# Altium project AEGIS_Junction_Box_driver.PrjPcb
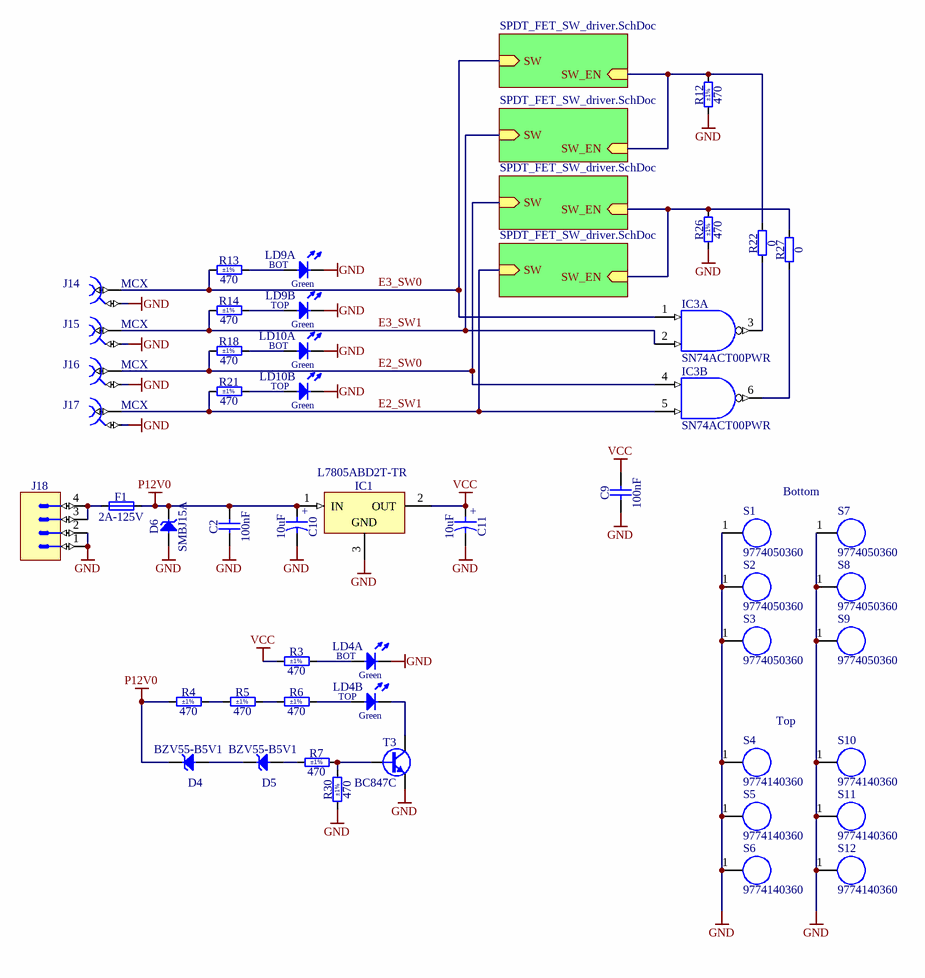
[diagram p0: AEGIS_Junction_Box_driver.SchDoc]
2 sheets, 181 parts. Net scope: hierarchical (ports join the sheet entries above them; power ports are global).
Board file: AEGIS_Junction_Box_driver.PcbDoc
Sheets:
  AEGIS_Junction_Box_driver.SchDoc
    SPDT_HV_SW0 = SPDT_FET_SW_driver.SchDoc
    SPDT_HV_SW1 = SPDT_FET_SW_driver.SchDoc
    SPDT_HV_SW2 = SPDT_FET_SW_driver.SchDoc
    SPDT_HV_SW3 = SPDT_FET_SW_driver.SchDoc

## Sheet AEGIS_Junction_Box_driver.SchDoc: AEGIS
size 420 x 297 mm; Author: G.Kasprowicz; CompanyName: WUT ISE; DrawnBy: G.Kasprowicz; Organization: WUT ISE; Address1: PW ISE; Address2: Nowowiejska 15/19 00-665 Warsaw; Address3: gkasprow@gmail.com; Revision: 2; SheetNumber: -; SheetTotal: -; ModifiedBy: -; CheckedDate: -; Title2: Junction Box Driver; DivGrp: WUT ISE; Designer: G.Kasprowicz; ModifiedDate: -; ProjectName: Sensor Box

### Parts
C2  100nF  [CAPC1005X55N]
C9  100nF  [CAPC1005X55N]
C10  10uF  [CAPMP3216X180N]
C11  10uF  [CAPMP3216X180N]
D4  BZV55-B5V1  [DIOMELF3515N]
D5  BZV55-B5V1  [DIOMELF3515N]
D6  SMBJ15A  [DIOM5336X265N]
F1  2A-125V  [FUSE_LITTELFUSE_0154]
IC1  L7805ABD2T-TR  [TO254P1542X460-3N-R790X1040]
IC3  SN74ACT00PWR  [SOP65P640X120-14N]  (parts A,B of 4)
J14  MCX  [AMPHENOL_919-383J-51A]
J15  MCX  [AMPHENOL_919-383J-51A]
J16  MCX  [AMPHENOL_919-383J-51A]
J17  MCX  [AMPHENOL_919-383J-51A]
J18  Mini-Fit Jr.™  [MOLEX_39-30-0040]  (value not drawn)
LD4  Green  [LED_DIALIGHT_553-0222-210F]  (value not drawn)  (parts A,B of 2)
LD9  Green  [LED_DIALIGHT_553-0222-210F]  (value not drawn)  (parts A,B of 2)
LD10  Green  [LED_DIALIGHT_553-0222-210F]  (value not drawn)  (parts A,B of 2)
R3  470  Tolerance: ±1%  [RESC1608X55N]
R4  470  Tolerance: ±1%  [RESC1608X55N]
R5  470  Tolerance: ±1%  [RESC1608X55N]
R6  470  Tolerance: ±1%  [RESC1608X55N]
R7  470  Tolerance: ±1%  [RESC1608X55N]
R12  470  Tolerance: ±1%  [RESC1608X55N]
R13  470  Tolerance: ±1%  [RESC1608X55N]
R14  470  Tolerance: ±1%  [RESC1608X55N]
R18  470  Tolerance: ±1%  [RESC1608X55N]
R21  470  Tolerance: ±1%  [RESC1608X55N]
R22  0  [RESC1608X55N]
R26  470  Tolerance: ±1%  [RESC1608X55N]
R27  0  [RESC1608X55N]
R30  470  Tolerance: ±1%  [RESC1608X55N]
S1  9774050360  [9774050360]
S2  9774050360  [9774050360]
S3  9774050360  [9774050360]
S4  9774140360  [9774140360]
S5  9774140360  [9774140360]
S6  9774140360  [9774140360]
S7  9774050360  [9774050360]
S8  9774050360  [9774050360]
S9  9774050360  [9774050360]
S10  9774140360  [9774140360]
S11  9774140360  [9774140360]
S12  9774140360  [9774140360]
T3  BC847C  [SOT95P240X110-3N]

### Sub-sheets
SPDT_HV_SW0 = SPDT_FET_SW_driver.SchDoc: SW (in), SW_EN (in)
SPDT_HV_SW1 = SPDT_FET_SW_driver.SchDoc: SW (in), SW_EN (in)
SPDT_HV_SW2 = SPDT_FET_SW_driver.SchDoc: SW (in), SW_EN (in)
SPDT_HV_SW3 = SPDT_FET_SW_driver.SchDoc: SW (in), SW_EN (in)

### Nets
GND: C2.1 C9.1 C10.2 C11.2 D6.2(A) IC1.3(GND) IC3.7(GND) J14.2 J15.2 J16.2 J17.2 J18.1 J18.2 LD4.2(C) LD9.2(C) LD9.4(C) LD10.2(C) LD10.4(C) R12.1 R26.1 R30.1 S1.1 S2.1 S3.1 S4.1 S5.1 S6.1 S7.1 S8.1 S9.1 S10.1 S11.1 S12.1 T3.2(E)
P12V0: C2.2 C10.1 D4.1(C) D6.1(C) F1.2 IC1.1(IN) R4.1
VCC: C9.2 C11.1 IC1.2(OUT) IC3.14(VCC) R3.1
E2_SW0: IC3.4(A) J16.1 R18.1 ; sheet SPDT_HV_SW2/SW
E2_SW1: IC3.5(B) J17.1 R21.1 ; sheet SPDT_HV_SW3/SW
E3_SW0: IC3.1(A) J14.1 R13.1 ; sheet SPDT_HV_SW0/SW
E3_SW1: IC3.2(B) J15.1 R14.1 ; sheet SPDT_HV_SW1/SW
NetD4_2: D4.2(A) D5.1(C)
NetD5_2: D5.2(A) R7.1
NetF1_1: F1.1 J18.3 J18.4
NetIC2A_1: R12.2 R22.2 ; sheet SPDT_HV_SW0/SW_EN, sheet SPDT_HV_SW1/SW_EN
NetIC2C_1: R26.2 R27.2 ; sheet SPDT_HV_SW2/SW_EN, sheet SPDT_HV_SW3/SW_EN
NetIC3_3: IC3.3(~{O}) R22.1
NetIC3_6: IC3.6(~{O}) R27.1
NetLD4_1: LD4.1(A) R3.2
NetLD4_3: LD4.3(A) R6.2
NetLD4_4: LD4.4(C) T3.3(C)
NetLD9_1: LD9.1(A) R13.2
NetLD9_3: LD9.3(A) R14.2
NetLD10_1: LD10.1(A) R18.2
NetLD10_3: LD10.3(A) R21.2
NetR4_2: R4.2 R5.1
NetR5_2: R5.2 R6.1
NetR7_2: R7.2 R30.2 T3.1(B)

### Notes on the sheet
- Bottom
- Top
- Project/Equipment
- Document
- Designer
- Drawn by
- Check.by
- Copyright WUT ISE 2020.
  This documentation describes Open Hardware and is licensed under the CERN OHL v.1.2. You may redistribute and modify this documentation under the terms of the CERN OHL v.1.2. (http://ohwr.org/CERNOHL). This documentation is distributed WITHOUT ANY EXPRESS OR IMPLIED WARRANTY, INCLUDING OF MERCHANTABILITY, SATISFACTORY QUALITY AND FITNESS FOR A PARTICULAR PURPOSE. Please see the CERN OHL v.1.2 for applicable conditions.
- Contact
- File
- Last Mod.
- Print Date
- Sheet
- Size
- A3
- of
- Rev
- (in symbol CTE3216-18_10UF_16V_20%_AVX_TCJ) +
- (in symbol LED_DIALIGHT_553-0222-210F, part A) BOT
- (in symbol LED_DIALIGHT_553-0222-210F, part B) TOP

### Library data of the parts
C2 C9 = CC0402_100NF_16V_10%_X7R: Non-polarised capacitor; Part Description: SMD Multilayer Chip Ceramic Capacitor; Manufacturer: GENERIC; Manufacturer1 Part Number: GRM155R71C104KA88D; Voltage: 16V; TC: X7R; Tolerance: ±10%; Part Number: CC0402_100NF_16V_10%_X7R; Component Kind: Standard; Component Type: Standard; Pin Count: 2; Value: 100nF; Status: Not Recommended; Manufacturer Part Number: CC0402_100NF_16V_10%_X7R; Case: 0402; Mounted: Yes; Socket: No; SMD: Yes; Sense: No; Manufacturer1 Example: MURATA; Manufacturer1 ComponentHeight: 0.55mm; HelpURL: \\cern.ch\dfs\Applications\Altium\Datasheets\CC0402_X7R_MURATA_GRM.pdf; Author: CERN DEM JLC; CreateDate: 05.12.2013; LatestRevisionDate: 03.12.2007
C10 C11 = CTE3216-18_10UF_16V_20%_AVX_TCJ: Polarised capacitor; Part Description: ESR 0R200 Tantalum Solid Electrolytic Chip Capacitor with Conductive Polymer Electrode; Manufacturer: AVX; Manufacturer Part Number: TCJA106M016R0200; Voltage: 16V; Tolerance: ±20%; Part Number: CTE3216-18_10UF_16V_20%_AVX_TCJ; Component Kind: Standard; Component Type: Standard; Pin Count: 2; Value: 10uF; Status: Preferred; Case: A; Mounted: Yes; Socket: No; SMD: Yes; Sense: No; ComponentHeight: 1.8mm; HelpURL: \\cern.ch\dfs\Applications\Altium\Datasheets\CTE_AVX_TCJ.pdf; Author: CERN DEM JLC; CreateDate: 29.03.2012; LatestRevisionDate: 29.03.2012
D4 D5 = BZV55-B5V1: Zener Diode; Part Description: Voltage Regulator Diode; Manufacturer: NEXPERIA; Voltage: 5V1; Power: 500mW; PressFit: No; Bonding: No; Part Number: BZV55-B5V1; Component Kind: Standard; Component Type: Standard; Device: BZV55-B5V1; PackageDescription: SOD80C, MELF Diode, 2-Leads, Body 3.5x1.5mm, IPC Medium Density; Manufacturer Part Number: BZV55-B5V1; Pin Count: 2; Case: SOD-80C; Mounted: Yes; Socket: No; SMD: Yes; Sense: No; ComponentHeight: 1.6mm; HelpURL: \\cern.ch\dfs\Applications\Altium\Datasheets\BZV55.pdf; Author: CERN DEM JLC; CreateDate: 06.05.2008; LatestRevisionDate: 22.01.2018
D6 = SMBJ15A: Zener Diode; Part Description: Uni-Directional Transient Voltage Suppressor Diode; Manufacturer: FAIRCHILD SEMICONDUCTOR; Voltage: 15V; Power: 600W; PressFit: No; Bonding: No; Part Number: SMBJ15A; Component Kind: Standard; Component Type: Standard; Device: SMBJ15A; PackageDescription: DO-214-AA/SMB Diode, Molded Body; 5.34mm L X 3.625mm W X 2.65mm H, IPC Medium Density; Manufacturer Part Number: SMBJ15A; Pin Count: 2; Case: DO-214AA; Mounted: Yes; Socket: No; SMD: Yes; Sense: No; ComponentHeight: 2.65mm; HelpURL: \\cern.ch\dfs\Applications\Altium\Datasheets\SMBJ.pdf; Author: CERN DEM JLC; CreateDate: 08.12.2008; LatestRevisionDate: 19.12.2011
F1 = FUSE_LITTELFUSE_0154002.DRT: Fuse; Part Description: SMF OMNI-BLOK® Fuse With Time Lag (Slo-Blo®) and Holder; PressFit: No; Part Number: FUSE_LITTELFUSE_0154002.DRT; Component Kind: Standard; Component Type: Standard; Pin Count: 2; PackageDescription: SMF Fuse and Holder, 2-Leads, Body 9.73x5.03mm; Family: Fuse & Holder; Mounted: Yes; Socket: No; SMD: Yes; Sense: No; Value: 2A-125V; Manufacturer: LITTELFUSE; Manufacturer Part Number: 0154002.DRT; ComponentHeight: 3.81mm; HelpURL: \\cern.ch\dfs\Applications\Altium\Datasheets\FUSE_LITTELFUSE_0154.pdf; Author: CERN DEM JLC; CreateDate: 06.08.2009; LatestRevisionDate: 06.08.2009
IC1 = L7805ABD2T-TR: 3-Terminal Regulator 1=IN 2=OUT 3=GND; Part Description: 5V 1.5A Positive Voltage Regulator; Manufacturer: ST MICROELECTRONICS; PressFit: No; Bonding: No; Part Number: L7805ABD2T-TR; Component Kind: Standard; Component Type: Standard; Device: L7805ABD2T-TR; PackageDescription: D2PAK TO-263, TO, 2.54mm Pitch; 2 Pin, 15.425mm L X 9.15mm W X 4.60mm H body, IPC Medium Density; Manufacturer Part Number: L7805ABD2T-TR; Pin Count: 3; Case: TO-263-2; Mounted: Yes; Socket: No; SMD: Yes; Sense: No; ComponentHeight: 4.6mm; HelpURL: \\cern.ch\dfs\Applications\Altium\Datasheets\L7805ABD2T-TR.pdf; Author: CERN DEM JLC; CreateDate: 13.12.2011; LatestRevisionDate: 13.12.2011
IC3 = SN74ACT00PWR: Quad 2-Input NAND Gate; Part Description: Quadruple 2-Input Positive-NAND Gate; Manufacturer: TEXAS INSTRUMENTS; PressFit: No; Bonding: No; Part Number: SN74ACT00PWR; Component Kind: Standard; Component Type: Standard; Device: SN74ACT00PWR; PackageDescription: SOP, 0.65mm Pitch; 14 Pin, 4.40mm W X 5.00mm L X 1.20mm H body, IPC Medium Density; Manufacturer Part Number: SN74ACT00PWR; Pin Count: 14; Case: TSSOP14; Mounted: Yes; Socket: No; SMD: Yes; Sense: No; ComponentHeight: 1.2mm; Author: CERN DEM JLC; HelpURL: \\cern.ch\dfs\Applications\Altium\Datasheets\SN74ACT00PWR.pdf; CreateDate: 17.03.2014; LatestRevisionDate: 17.03.2014
J14-J17 = AMPHENOL_919-383J-51A: Part Description: 50 Ohm, RF Connector, MCX Right Angle PCB Receptacle Jack; PressFit: No; Part Number: AMPHENOL_919-383J-51A; Component Kind: Standard; Component Type: Standard; Pin Count: 5; Family: MCX; Mounted: Yes; Socket: No; SMD: No; Sense: No; Status: None; Manufacturer: AMPHENOL; Manufacturer Part Number: 919-383J-51A; ComponentHeight: 6mm; HelpURL: \\cern.ch\dfs\Applications\Altium\Datasheets\AMPHENOL_919-383J-51A.pdf; Author: CERN DEM BC; CreateDate: 31.01.2019; LatestRevisionDate: 31.01.2019
J18 = MOLEX_39-30-0040: Connector 4 Male; Part Description: 4.20mm (.165") Pitch Mini-Fit Jr. Header, Dual Row, Right Angle with Snap-in Plastic Peg PCB Lock, 4 Circuits; Manufacturer: MOLEX; PressFit: No; Part Number: MOLEX_39-30-0040; Component Kind: Standard; Component Type: Standard; Pin Count: 4; Family: Mini-Fit Jr.™; Mounted: Yes; Socket: No; SMD: No; Sense: No; Status: None; Manufacturer Part Number: 39-30-0040; ComponentHeight: 11.4mm; HelpURL: \\cern.ch\dfs\Applications\Altium\Datasheets\MOLEX_39-30-0040.pdf; Author: CERN DEM JLC; CreateDate: 2018-10-02; LatestRevisionDate: 2018-10-02
LD4 LD9 LD10 = LED_DIALIGHT_553-0222-210F: LED x2 Green 1A2C-BOT_3A4C-TOP; Part Description: Dual 3mm Green LED CBI® Circuit Board Indicator, Low Current, Reverse Cathode Right; PressFit: No; Bonding: No; Part Number: LED_DIALIGHT_553-0222-210F; Component Kind: Standard; Component Type: Standard; Color: Green; PackageDescription: Dual 3mm Green LED, Body 10.55x4.32mm, Pin spacing 2.54mm, Reverse Cathode Right; Manufacturer: DIALIGHT; Manufacturer Part Number: 553-0222-210F; Pin Count: 4; Mounted: Yes; Socket: No; SMD: No; Sense: No; ComponentHeight: 9.65mm; HelpURL: \\cern.ch\dfs\Applications\Altium\Datasheets\LED_DIALIGHT_553-0222-210F.pdf; Author: CERN DEM BC; CreateDate: 18.08.2016; LatestRevisionDate: 18.08.2016
R3-R7 R12-R14 R18 R21 R26 R30 = R0603_470R_1%_0.1W_100PPM: Resistor - 1%; Part Description: General Purpose Thick Film Chip Resistor; Manufacturer: GENERIC; Manufacturer1 Part Number: NRC06F4700TRF; Power: 0.1W; TC: ±100ppm/°C; PressFit: No; Part Number: R0603_470R_1%_0.1W_100PPM; Component Kind: Standard; Component Type: Standard; Pin Count: 2; Value: 470; Status: Preferred; Manufacturer Part Number: R0603_470R_1%_0.1W_100PPM; Case: 0603; Mounted: Yes; Sense: No; Socket: No; SMD: Yes; Manufacturer1 Example: NIC COMPONENT; Manufacturer1 ComponentHeight: 0.55mm; HelpURL: \\cern.ch\dfs\Applications\Altium\Datasheets\R0603_NIC_NRC.pdf; Author: CERN DEM JLC; CreateDate: 03.12.2007; LatestRevisionDate: 13.03.2008
R22 R27 = R0603_0R_JUMPER: Resistor; Part Description: 1A (0.05R Max DC Resistance) Zero Ohm Jumper; Manufacturer: GENERIC; Manufacturer1 Part Number: NRC06Z0; PressFit: No; Part Number: R0603_0R_JUMPER; Component Kind: Standard; Component Type: Standard; Pin Count: 2; Value: 0; Status: Preferred; Manufacturer Part Number: R0603_0R_JUMPER; Case: 0603; Mounted: Yes; Sense: No; Socket: No; SMD: Yes; Manufacturer1 Example: NIC COMPONENT; Manufacturer1 ComponentHeight: 0.55mm; HelpURL: \\cern.ch\dfs\Applications\Altium\Datasheets\R0603_NIC_NRC.pdf; Author: CERN DEM JLC; CreateDate: 03.12.2007; LatestRevisionDate: 13.03.2008
S1-S3 S7-S9 = WA-SMSI,  9774050360: WA-SMSI SMD Steel Spacer with internal Thread; Manufacturer: Wurth Elektronik; partNo: 9774050360; ComponentLink1Description: Manufacturer; ComponentLink1URL: http://www.we-online.de; Created by: Baojun Chen; Created Date: 20.Oct.2015; ComponentLink2Description: Datasheet; ComponentLink2URL: http://katalog.we-online.de/em/datasheet/9774050360.pdf
S4-S6 S10-S12 = WA-SMSI,  9774140360: WA-SMSI SMD Steel Spacer with internal Thread; Manufacturer: Wurth Elektronik; partNo: 9774140360; ComponentLink1Description: Manufacturer; ComponentLink1URL: http://www.we-online.de; Created by: Baojun Chen; Created Date: 20.Oct.2015; ComponentLink2Description: Datasheet; ComponentLink2URL: http://katalog.we-online.de/em/datasheet/9774140360.pdf
T3 = BC847C: NPN Transistor; Part Description: 45V 100mA NPN Silicon AF Transistor; Manufacturer: INFINEON; PressFit: No; Bonding: No; Part Number: BC847C; Component Kind: Standard; Component Type: Standard; Device: BC847C; PackageDescription: SOT23, 0.95mm Pitch; 3 Pin, 1.40mm W X 3.00mm L X 1.10mm H body, IPC Medium Density; Manufacturer Part Number: BC847C; Pin Count: 3; Case: SOT23-3; Mounted: Yes; Socket: No; SMD: Yes; Sense: No; ComponentHeight: 1.1mm; HelpURL: \\cern.ch\dfs\Applications\Altium\Datasheets\BC847C.pdf; Author: CERN DEM JLC; CreateDate: 23.09.2014; LatestRevisionDate: 23.09.2014

## Sheet SPDT_FET_SW_driver.SchDoc: AEGIS
size 420 x 297 mm; Author: G.Kasprowicz; CompanyName: WUT ISE; DrawnBy: G.Kasprowicz; Organization: WUT ISE; Address1: PW ISE; Address2: Nowowiejska 15/19 00-665 Warsaw; Address3: gkasprow@gmail.com; Revision: 2; SheetNumber: -; SheetTotal: -; ModifiedBy: -; CheckedDate: -; Title2: Switch driver; DivGrp: WUT ISE; Designer: G.Kasprowicz; ModifiedDate: -; ProjectName: Sensor Box
Used 4 times, as channels SPDT_HV_SW0, SPDT_HV_SW1, SPDT_HV_SW2, SPDT_HV_SW3. Parts and nets are listed once, with the designators drawn on the sheet.
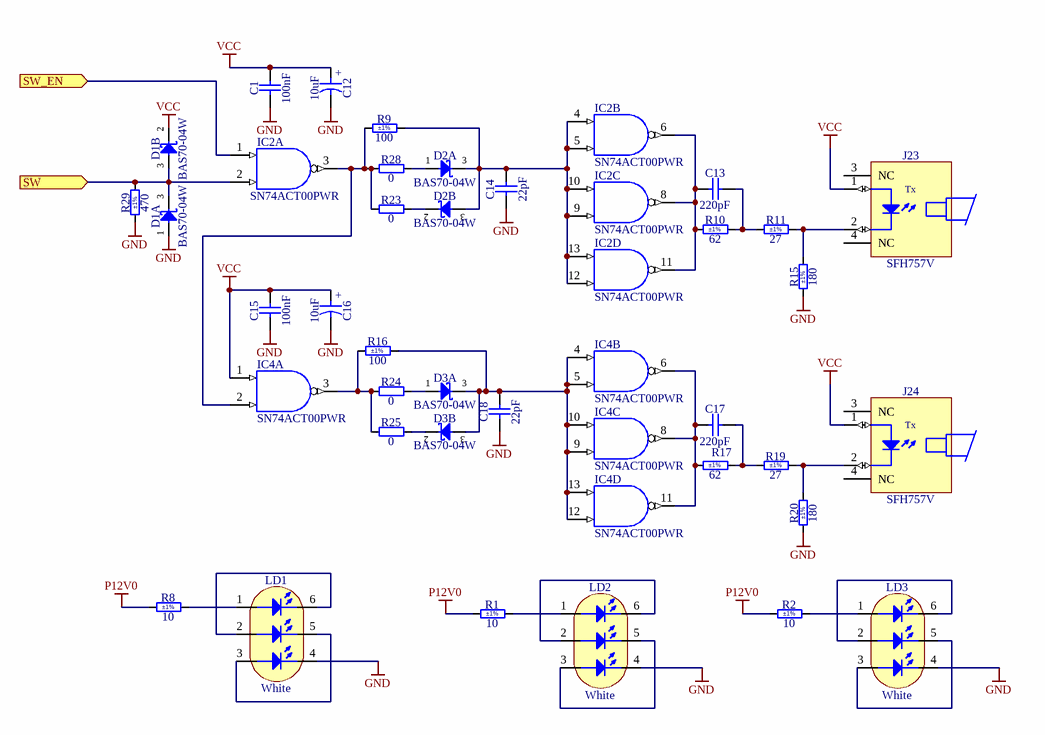
[diagram p1: SPDT_FET_SW_driver.SchDoc]

### Parts
C1  100nF  [CAPC1005X55N]
C12  10uF  [CAPMP3216X180N]
C13  220pF  [CAPC1608X87N]
C14  22pF  [CAPC1608X87N]
C15  100nF  [CAPC1005X55N]
C16  10uF  [CAPMP3216X180N]
C17  220pF  [CAPC1608X87N]
C18  22pF  [CAPC1608X87N]
D1  BAS70-04W  [SOT65P210X110-3N]  (parts A,B of 2)
D2  BAS70-04W  [SOT65P210X110-3N]  (parts A,B of 2)
D3  BAS70-04W  [SOT65P210X110-3N]  (parts A,B of 2)
IC2  SN74ACT00PWR  [SOP65P640X120-14N]  (parts A,B,C,D of 4)
IC4  SN74ACT00PWR  [SOP65P640X120-14N]  (parts A,B,C,D of 4)
J23  SFH757V  [SFH756V]
J24  SFH757V  [SFH756V]
LD1  White  [LED_CREE_CLP6B-WKW]
LD2  White  [LED_CREE_CLP6B-WKW]
LD3  White  [LED_CREE_CLP6B-WKW]
R1  10  Tolerance: ±1%  [RESC3216X65N]
R2  10  Tolerance: ±1%  [RESC3216X65N]
R8  10  Tolerance: ±1%  [RESC3216X65N]
R9  100  Tolerance: ±1%  [RESC1608X55N]
R10  62  Tolerance: ±1%  [RESC2012X60N]
R11  27  Tolerance: ±1%  [RESC2012X60N]
R15  180  Tolerance: ±1%  [RESC3216X65N]
R16  100  Tolerance: ±1%  [RESC1608X55N]
R17  62  Tolerance: ±1%  [RESC2012X60N]
R19  27  Tolerance: ±1%  [RESC2012X60N]
R20  180  Tolerance: ±1%  [RESC3216X65N]
R23  0  [RESC1608X55N]
R24  0  [RESC1608X55N]
R25  0  [RESC1608X55N]
R28  0  [RESC1608X55N]
R29  470  Tolerance: ±1%  [RESC1608X55N]

### Ports
SW (in), SW_EN (in)

### Nets
GND: C1.1 C12.2 C14.1 C15.1 C16.2 C18.1 D1.1(A) IC2.7(GND) IC4.7(GND) LD1.4(C3) LD2.4(C3) LD3.4(C3) R15.1 R20.1 R29.1
P12V0: R1.1 R2.1 R8.1
VCC: C1.2 C12.1 C15.2 C16.1 D1.2(C) IC2.14(VCC) IC4.1(A) IC4.14(VCC) J23.1(A) J24.1(A)
SW: D1.3(COMAC) IC2.2(B) R29.2 ; port SW
SW_EN: IC2.1(A) ; port SW_EN
NetC13_1: C13.1 IC2.6(~{O}) IC2.8(~{O}) IC2.11(~{O}) R10.1
NetC13_2: C13.2 R10.2 R11.1
NetC14_2: C14.2 D2.3(COMAC) IC2.4(A) IC2.5(B) IC2.9(B) IC2.10(A) IC2.12(B) IC2.13(A) R9.2
NetC17_1: C17.1 IC4.6(~{O}) IC4.8(~{O}) IC4.11(~{O}) R17.1
NetC17_2: C17.2 R17.2 R19.1
NetC18_2: C18.2 D3.3(COMAC) IC4.4(A) IC4.5(B) IC4.9(B) IC4.10(A) IC4.12(B) IC4.13(A) R16.2
NetD2_1: D2.1(A) R28.2
NetD2_2: D2.2(C) R23.2
NetD3_1: D3.1(A) R24.2
NetD3_2: D3.2(C) R25.2
NetIC2_3: IC2.3(~{O}) IC4.2(B) R9.1 R23.1 R28.1
NetIC4_3: IC4.3(~{O}) R16.1 R24.1 R25.1
NetJ23_2: J23.2(C) R11.2 R15.2
NetJ24_2: J24.2(C) R19.2 R20.2
NetLD1_1: LD1.1(A1) R8.2
NetLD1_2: LD1.2(A2) LD1.6(C1)
NetLD1_3: LD1.3(A3) LD1.5(C2)
NetLD2_1: LD2.1(A1) R1.2
NetLD2_2: LD2.2(A2) LD2.6(C1)
NetLD2_3: LD2.3(A3) LD2.5(C2)
NetLD3_1: LD3.1(A1) R2.2
NetLD3_2: LD3.2(A2) LD3.6(C1)
NetLD3_3: LD3.3(A3) LD3.5(C2)

Not connected (* = marked no-connect by the designer): J23 3(NC) 4(NC); J24 3(NC) 4(NC)

### Channels
SPDT_HV_SW0: designators end in A; ports SW=E3_SW0 SW_EN=NetIC2A_1
SPDT_HV_SW1: designators end in B; ports SW=E3_SW1 SW_EN=NetIC2A_1
SPDT_HV_SW2: designators end in C; ports SW=E2_SW0 SW_EN=NetIC2C_1
SPDT_HV_SW3: designators end in D; ports SW=E2_SW1 SW_EN=NetIC2C_1

### Notes on the sheet
- Project/Equipment
- Document
- Designer
- Drawn by
- Check.by
- Copyright WUT ISE 2020.
  This documentation describes Open Hardware and is licensed under the CERN OHL v.1.2. You may redistribute and modify this documentation under the terms of the CERN OHL v.1.2. (http://ohwr.org/CERNOHL). This documentation is distributed WITHOUT ANY EXPRESS OR IMPLIED WARRANTY, INCLUDING OF MERCHANTABILITY, SATISFACTORY QUALITY AND FITNESS FOR A PARTICULAR PURPOSE. Please see the CERN OHL v.1.2 for applicable conditions.
- Contact
- File
- Last Mod.
- Print Date
- Sheet
- Size
- A3
- of
- Rev
- (in symbol CTE3216-18_10UF_16V_20%_AVX_TCJ) +
- (in symbol SFH756V) Tx

### Library data of the parts
C1 C15 = CC0402_100NF_16V_10%_X7R: as C2 on sheet AEGIS_Junction_Box_driver; Part Number: CC0402_100NF_16V_10%_X7R; Component Kind: Standard; Component Type: Standard; Pin Count: 2; Value: 100nF; Status: Not Recommended; Manufacturer Part Number: CC0402_100NF_16V_10%_X7R; Case: 0402; Mounted: Yes; Socket: No; SMD: Yes; Sense: No; Manufacturer1 Example: MURATA; Manufacturer1 ComponentHeight: 0.55mm; HelpURL: \\cern.ch\dfs\Applications\Altium\Datasheets\CC0402_X7R_MURATA_GRM.pdf; Author: CERN DEM JLC; CreateDate: 05.12.2013; LatestRevisionDate: 03.12.2007
C12 C16 = CTE3216-18_10UF_16V_20%_AVX_TCJ: as C10 on sheet AEGIS_Junction_Box_driver; Part Number: CTE3216-18_10UF_16V_20%_AVX_TCJ; Component Kind: Standard; Component Type: Standard; Pin Count: 2; Value: 10uF; Status: Preferred; Case: A; Mounted: Yes; Socket: No; SMD: Yes; Sense: No; ComponentHeight: 1.8mm; HelpURL: \\cern.ch\dfs\Applications\Altium\Datasheets\CTE_AVX_TCJ.pdf; Author: CERN DEM JLC; CreateDate: 29.03.2012; LatestRevisionDate: 29.03.2012
C13 C17 = CC0603_220PF_50V_5%_NP0: Non-polarised capacitor; Part Description: SMD Multilayer Chip Ceramic Capacitor; Manufacturer: GENERIC; Manufacturer1 Part Number: 223886715221; Voltage: 50V; TC: C0G/NP0; Tolerance: ±5%; Part Number: CC0603_220PF_50V_5%_NP0; Component Kind: Standard; Component Type: Standard; Pin Count: 2; Value: 220pF; Status: Preferred; Manufacturer Part Number: CC0603_220PF_50V_5%_NP0; Case: 0603; Mounted: Yes; Socket: No; SMD: Yes; Sense: No; Manufacturer1 Example: PHYCOMP; Manufacturer1 ComponentHeight: 0.87mm; HelpURL: \\cern.ch\dfs\Applications\Altium\Datasheets\CC0603_NP0_PHYCOMP.pdf; Author: CERN DEM JLC; CreateDate: 03.12.2007; LatestRevisionDate: 03.12.2007
C14 C18 = CC0603_22PF_50V_5%_NP0: Non-polarised capacitor; Part Description: SMD Multilayer Chip Ceramic Capacitor; Manufacturer: GENERIC; Manufacturer1 Part Number: 223886715229; Voltage: 50V; TC: C0G/NP0; Tolerance: ±5%; Part Number: CC0603_22PF_50V_5%_NP0; Component Kind: Standard; Component Type: Standard; Pin Count: 2; Value: 22pF; Status: Preferred; Manufacturer Part Number: CC0603_22PF_50V_5%_NP0; Case: 0603; Mounted: Yes; Socket: No; SMD: Yes; Sense: No; Manufacturer1 Example: PHYCOMP; Manufacturer1 ComponentHeight: 0.87mm; HelpURL: \\cern.ch\dfs\Applications\Altium\Datasheets\CC0603_NP0_PHYCOMP.pdf; Author: CERN DEM JLC; CreateDate: 03.12.2007; LatestRevisionDate: 03.12.2007
D1-D3 = BAS70-04W: Serial Schottky Diode; Part Description: Dual Series General-Purpose Schottky Diodes; Manufacturer: NXP SEMICONDUCTORS; Voltage: 70V; Power: 70mA; PressFit: No; Bonding: No; Part Number: BAS70-04W; Component Kind: Standard; Component Type: Standard; Device: BAS70-04W; PackageDescription: SOT323, 0.65mm Pitch; 3 Pin, 1.25mm W X 2.00mm L X 1.10mm H body, IPC Medium Density; Manufacturer Part Number: BAS70-04W; Pin Count: 3; Case: SOT323; Mounted: Yes; Socket: No; SMD: Yes; Sense: No; ComponentHeight: 1.10mm; HelpURL: \\cern.ch\dfs\Applications\Altium\Datasheets\BAS70-04W.pdf; Author: CERN DEM JLC; CreateDate: 05.12.2013; LatestRevisionDate: 05.12.2013
IC2 IC4 = SN74ACT00PWR: as IC3 on sheet AEGIS_Junction_Box_driver; Part Number: SN74ACT00PWR; Component Kind: Standard; Component Type: Standard; Device: SN74ACT00PWR; PackageDescription: SOP, 0.65mm Pitch; 14 Pin, 4.40mm W X 5.00mm L X 1.20mm H body, IPC Medium Density; Manufacturer Part Number: SN74ACT00PWR; Pin Count: 14; Case: TSSOP14; Mounted: Yes; Socket: No; SMD: Yes; Sense: No; ComponentHeight: 1.2mm; Author: CERN DEM JLC; HelpURL: \\cern.ch\dfs\Applications\Altium\Datasheets\SN74ACT00PWR.pdf; CreateDate: 17.03.2014; LatestRevisionDate: 17.03.2014
J23 J24 = SFH756V: Plastic Connector Housing For Plastic Fiber Optic Photodiode Detector; Part Description: 100MBd Transmitter with Direct Fiber Connector; Manufacturer: AVAGO TECHNOLOGIES; Manufacturer Part Number: SFH756V or SP000063814; PressFit: No; Part Number: SFH757V; Component Kind: Standard; Component Type: Standard; Device: SFH757V; Footprint: SFH757V; Pin Count: 4; Family: SFH757V; Mounted: Yes; Socket: No; SMD: No; Sense: No; Status: None; ComponentHeight: 9mm; HelpURL: \\cern.ch\dfs\Applications\Altium\Datasheets\SFH756V.pdf; Author: CERN DEM JLC; CreateDate: 11.11.2009; LatestRevisionDate: 21.08.2014
LD1-LD3 = LED_CREE_CLP6B-WKW-CD0E0233: PLCC6 3 in 1 Surface Mount, Cool White LED; Manufacturer: CREE; PressFit: No; Bonding: No; Part Number: LED_CREE_CLP6B-WKW-CD0E0233; Component Kind: Standard; Component Type: Standard; Color: White; PackageDescription: PLCC6 3 in 1 Surface Mount White LED, Body 6.0mm X 5.0mm; Part Description: PLCC6 3 in 1 Surface Mount, Cool White LED; Manufacturer Part Number: CLP6B-WKW-CD0E0233; Pin Count: 6; Mounted: Yes; Socket: No; SMD: Yes; Sense: No; ComponentHeight: 2.6mm; HelpURL: \\cern.ch\dfs\Applications\Altium\Datasheets\LED_CREE_CLP6B-WKW-CD0E0233.pdf; Author: CERN DEM JMW; CreateDate: 04.02.2020; LatestRevisionDate: 04.02.2020
R1 R2 R8 = R1206_10R_1%_0.25W_100PPM: Resistor - 1%; Part Description: General Purpose Thick Film Chip Resistor; Manufacturer: GENERIC; Manufacturer1 Part Number: NRC12F10R0TRF; Power: 0.25W; TC: ±100ppm/°C; PressFit: No; Part Number: R1206_10R_1%_0.25W_100PPM; Component Kind: Standard; Component Type: Standard; Pin Count: 2; Value: 10; Status: Preferred; Manufacturer Part Number: R1206_10R_1%_0.25W_100PPM; Case: 1206; Mounted: Yes; Sense: No; Socket: No; SMD: Yes; Manufacturer1 Example: NIC COMPONENT; Manufacturer1 ComponentHeight: 0.65mm; HelpURL: \\cern.ch\dfs\Applications\Altium\Datasheets\R1206_NIC_NRC.pdf; Author: CERN DEM BC; CreateDate: 14.12.2020; LatestRevisionDate: 14.12.2020
R9 R16 = R0603_100R_1%_0.1W_100PPM: Resistor - 1%; Part Description: General Purpose Thick Film Chip Resistor; Manufacturer: GENERIC; Manufacturer1 Part Number: NRC06F4700TRF; Power: 0.1W; TC: ±100ppm/°C; PressFit: No; Part Number: R0603_100R_1%_0.1W_100PPM; Component Kind: Standard; Component Type: Standard; Pin Count: 2; Value: 100; Status: Preferred; Manufacturer Part Number: R0603_100R_1%_0.1W_100PPM; Case: 0603; Mounted: Yes; Sense: No; Socket: No; SMD: Yes; Manufacturer1 Example: NIC COMPONENT; Manufacturer1 ComponentHeight: 0.55mm; HelpURL: \\cern.ch\dfs\Applications\Altium\Datasheets\R0603_NIC_NRC.pdf; Author: CERN DEM JLC; CreateDate: 03.12.2007; LatestRevisionDate: 13.03.2008
R10 R17 = R0805_62R_1%_0.125W_100PPM: Resistor - 1%; Part Description: General Purpose Thick Film Chip Resistor; Manufacturer: GENERIC; Manufacturer1 Part Number: NRC10F62R0TRF; Power: 0.125W; TC: ±100ppm/°C; PressFit: No; Part Number: R0805_62R_1%_0.125W_100PPM; Component Kind: Standard; Component Type: Standard; Pin Count: 2; Value: 62; Status: Preferred; Manufacturer Part Number: R0805_62R_1%_0.125W_100PPM; Case: 0805; Mounted: Yes; Sense: No; Socket: No; SMD: Yes; Manufacturer1 Example: NIC COMPONENT; Manufacturer1 ComponentHeight: 0.6mm; HelpURL: \\cern.ch\dfs\Applications\Altium\Datasheets\R0805_NIC_NRC.pdf; Author: CERN DEM JLC; CreateDate: 03.12.2007; LatestRevisionDate: 13.03.2008
R11 R19 = R0805_27R_1%_0.125W_100PPM: Resistor - 1%; Part Description: General Purpose Thick Film Chip Resistor; Manufacturer: GENERIC; Manufacturer1 Part Number: NRC10F27R0TRF; Power: 0.125W; TC: ±100ppm/°C; PressFit: No; Part Number: R0805_27R_1%_0.125W_100PPM; Component Kind: Standard; Component Type: Standard; Pin Count: 2; Value: 27; Status: Preferred; Manufacturer Part Number: R0805_27R_1%_0.125W_100PPM; Case: 0805; Mounted: Yes; Sense: No; Socket: No; SMD: Yes; Manufacturer1 Example: NIC COMPONENT; Manufacturer1 ComponentHeight: 0.6mm; HelpURL: \\cern.ch\dfs\Applications\Altium\Datasheets\R0805_NIC_NRC.pdf; Author: CERN DEM JLC; CreateDate: 03.12.2007; LatestRevisionDate: 13.03.2008
R15 R20 = R1206_180R_1%_0.25W_100PPM: Resistor - 1%; Part Description: General Purpose Thick Film Chip Resistor; Manufacturer: GENERIC; Manufacturer1 Part Number: NRC12F1800TRF; Power: 0.25W; TC: ±100ppm/°C; PressFit: No; Part Number: R1206_180R_1%_0.25W_100PPM; Component Kind: Standard; Component Type: Standard; Pin Count: 2; Value: 180; Status: Preferred; Manufacturer Part Number: R1206_180R_1%_0.25W_100PPM; Case: 1206; Mounted: Yes; Sense: No; Socket: No; SMD: Yes; Manufacturer1 Example: NIC COMPONENT; Manufacturer1 ComponentHeight: 0.65mm; HelpURL: \\cern.ch\dfs\Applications\Altium\Datasheets\R1206_NIC_NRC.pdf; Author: CERN DEM JLC; CreateDate: 03.12.2007; LatestRevisionDate: 13.03.2008
R23-R25 R28 = R0603_0R_JUMPER: as R22 on sheet AEGIS_Junction_Box_driver; Part Number: R0603_0R_JUMPER; Component Kind: Standard; Component Type: Standard; Pin Count: 2; Value: 0; Status: Preferred; Manufacturer Part Number: R0603_0R_JUMPER; Case: 0603; Mounted: Yes; Sense: No; Socket: No; SMD: Yes; Manufacturer1 Example: NIC COMPONENT; Manufacturer1 ComponentHeight: 0.55mm; HelpURL: \\cern.ch\dfs\Applications\Altium\Datasheets\R0603_NIC_NRC.pdf; Author: CERN DEM JLC; CreateDate: 03.12.2007; LatestRevisionDate: 13.03.2008
R29 = R0603_470R_1%_0.1W_100PPM: as R3 on sheet AEGIS_Junction_Box_driver; Part Number: R0603_470R_1%_0.1W_100PPM; Component Kind: Standard; Component Type: Standard; Pin Count: 2; Value: 470; Status: Preferred; Manufacturer Part Number: R0603_470R_1%_0.1W_100PPM; Case: 0603; Mounted: Yes; Sense: No; Socket: No; SMD: Yes; Manufacturer1 Example: NIC COMPONENT; Manufacturer1 ComponentHeight: 0.55mm; HelpURL: \\cern.ch\dfs\Applications\Altium\Datasheets\R0603_NIC_NRC.pdf; Author: CERN DEM JLC; CreateDate: 03.12.2007; LatestRevisionDate: 13.03.2008

## Nets that join several sheets
GND: AEGIS_Junction_Box_driver (34 pins), SPDT_HV_SW0 (15 pins), SPDT_HV_SW1 (15 pins), SPDT_HV_SW2 (15 pins), SPDT_HV_SW3 (15 pins)
P12V0: AEGIS_Junction_Box_driver (7 pins), SPDT_HV_SW0 (R1A.1 R2A.1 R8A.1), SPDT_HV_SW1 (R1B.1 R2B.1 R8B.1), SPDT_HV_SW2 (R1C.1 R2C.1 R8C.1), SPDT_HV_SW3 (R1D.1 R2D.1 R8D.1)
VCC: AEGIS_Junction_Box_driver (5 pins), SPDT_HV_SW0 (10 pins), SPDT_HV_SW1 (10 pins), SPDT_HV_SW2 (10 pins), SPDT_HV_SW3 (10 pins)
E2_SW0: AEGIS_Junction_Box_driver (IC3.4 J16.1 R18.1), SPDT_HV_SW2 (D1C.3 IC2C.2 R29C.2)
E2_SW1: AEGIS_Junction_Box_driver (IC3.5 J17.1 R21.1), SPDT_HV_SW3 (D1D.3 IC2D.2 R29D.2)
E3_SW0: AEGIS_Junction_Box_driver (IC3.1 J14.1 R13.1), SPDT_HV_SW0 (D1A.3 IC2A.2 R29A.2)
E3_SW1: AEGIS_Junction_Box_driver (IC3.2 J15.1 R14.1), SPDT_HV_SW1 (D1B.3 IC2B.2 R29B.2)
NetIC2A_1: AEGIS_Junction_Box_driver (R12.2 R22.2), SPDT_HV_SW0 (IC2A.1), SPDT_HV_SW1 (IC2B.1)
NetIC2C_1: AEGIS_Junction_Box_driver (R26.2 R27.2), SPDT_HV_SW2 (IC2C.1), SPDT_HV_SW3 (IC2D.1)